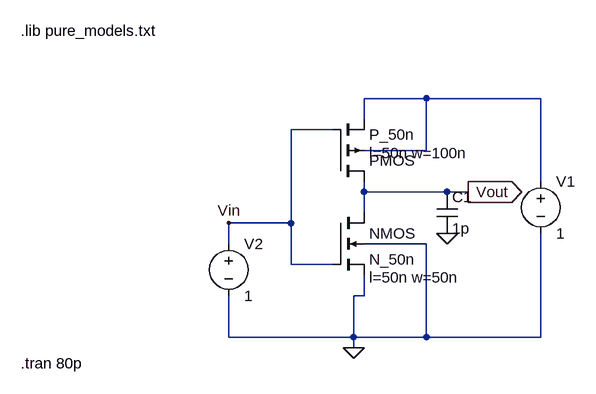
[diagram p0: schematic inv_sc_power.asc]
inv_sc_power.asc, the LTspice schematic file:
Version 4
SHEET 1 880 680
WIRE 320 32 224 32
WIRE 496 32 320 32
WIRE 224 64 224 32
WIRE 176 80 112 80
WIRE 320 112 320 32
WIRE 320 112 224 112
WIRE 496 160 496 32
WIRE 224 176 224 160
WIRE 352 176 224 176
WIRE 384 176 352 176
WIRE 224 208 224 176
WIRE 112 224 112 80
WIRE 112 224 16 224
WIRE 16 256 16 224
WIRE 320 256 224 256
WIRE 112 288 112 224
WIRE 176 288 112 288
WIRE 224 336 224 304
WIRE 224 336 208 336
WIRE 16 400 16 336
WIRE 208 400 208 336
WIRE 208 400 16 400
WIRE 320 400 320 256
WIRE 320 400 208 400
WIRE 496 400 496 240
WIRE 496 400 320 400
WIRE 208 416 208 400
FLAG 208 416 0
FLAG 16 224 Vin
FLAG 352 240 0
FLAG 384 176 Vout
IOPIN 384 176 Out
SYMBOL pmos4 176 160 M180
WINDOW 123 56 44 Left 2
SYMATTR Value2 l=50n w=100n
SYMATTR InstName PMOS
SYMATTR Value P_50n
SYMBOL nmos4 176 208 R0
WINDOW 123 56 100 Left 2
SYMATTR Value2 l=50n w=50n
SYMATTR InstName NMOS
SYMATTR Value N_50n
SYMBOL voltage 16 240 R0
WINDOW 123 0 0 Left 0
WINDOW 39 0 0 Left 0
SYMATTR InstName V2
SYMATTR Value 1
SYMBOL voltage 496 144 R0
SYMATTR InstName V1
SYMATTR Value 1
SYMBOL cap 336 176 R0
SYMATTR InstName C1
SYMATTR Value 1p
TEXT -304 -72 Left 2 !.lib pure_models.txt
TEXT -304 440 Left 2 !.tran 80p

The netlist it stands for:
* inv_sc_power.asc
M§PMOS Vout Vin N001 N001 P_50n l=50n w=100n
M§NMOS Vout Vin 0 0 N_50n l=50n w=50n
V2 Vin 0 1
V1 N001 0 1
C1 Vout 0 1p
.model NMOS NMOS
.model PMOS PMOS
.lib standard.mos
.lib pure_models.txt
.tran 80p
.backanno
.end